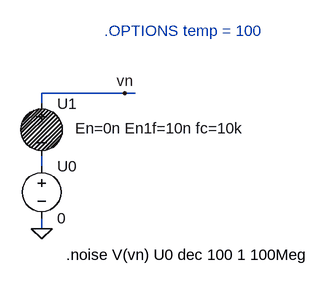
[diagram p0: schematic noisevoltagesrc_test.asc]
noisevoltagesrc_test.asc, the LTspice schematic file:
Version 4
SHEET 1 880 680
WIRE 64 -48 -64 -48
WIRE 80 -48 64 -48
WIRE -64 -32 -64 -48
WIRE -64 64 -64 48
WIRE -64 160 -64 144
FLAG -64 160 0
FLAG 64 -48 vn
SYMBOL voltage -64 48 R0
SYMATTR InstName U0
SYMATTR Value 0
SYMBOL circuiTikz\\noisevoltage -64 -48 R0
WINDOW 39 52 54 Left 2
SYMATTR InstName U1
SYMATTR SpiceLine En=0n En1f=10n fc=10k
TEXT -26 200 Left 2 !.noise V(vn) U0 dec 100 1 100Meg
TEXT 32 -144 Left 2 ;.OPTIONS temp = 100

The netlist it stands for:
* noisevoltagesrc_test.asc
V§U0 N001 0 0
XU1 vn N001 noisevoltagesource En=0n En1f=10n fc=10k  ; pins + -
.noise V(vn) U0 dec 100 1 100Meg
* .OPTIONS temp = 100
.lib circuiTikz/noisevoltagesource.sub
.backanno
.end